# Altium schematic sheet FMs.SchDoc
size A2
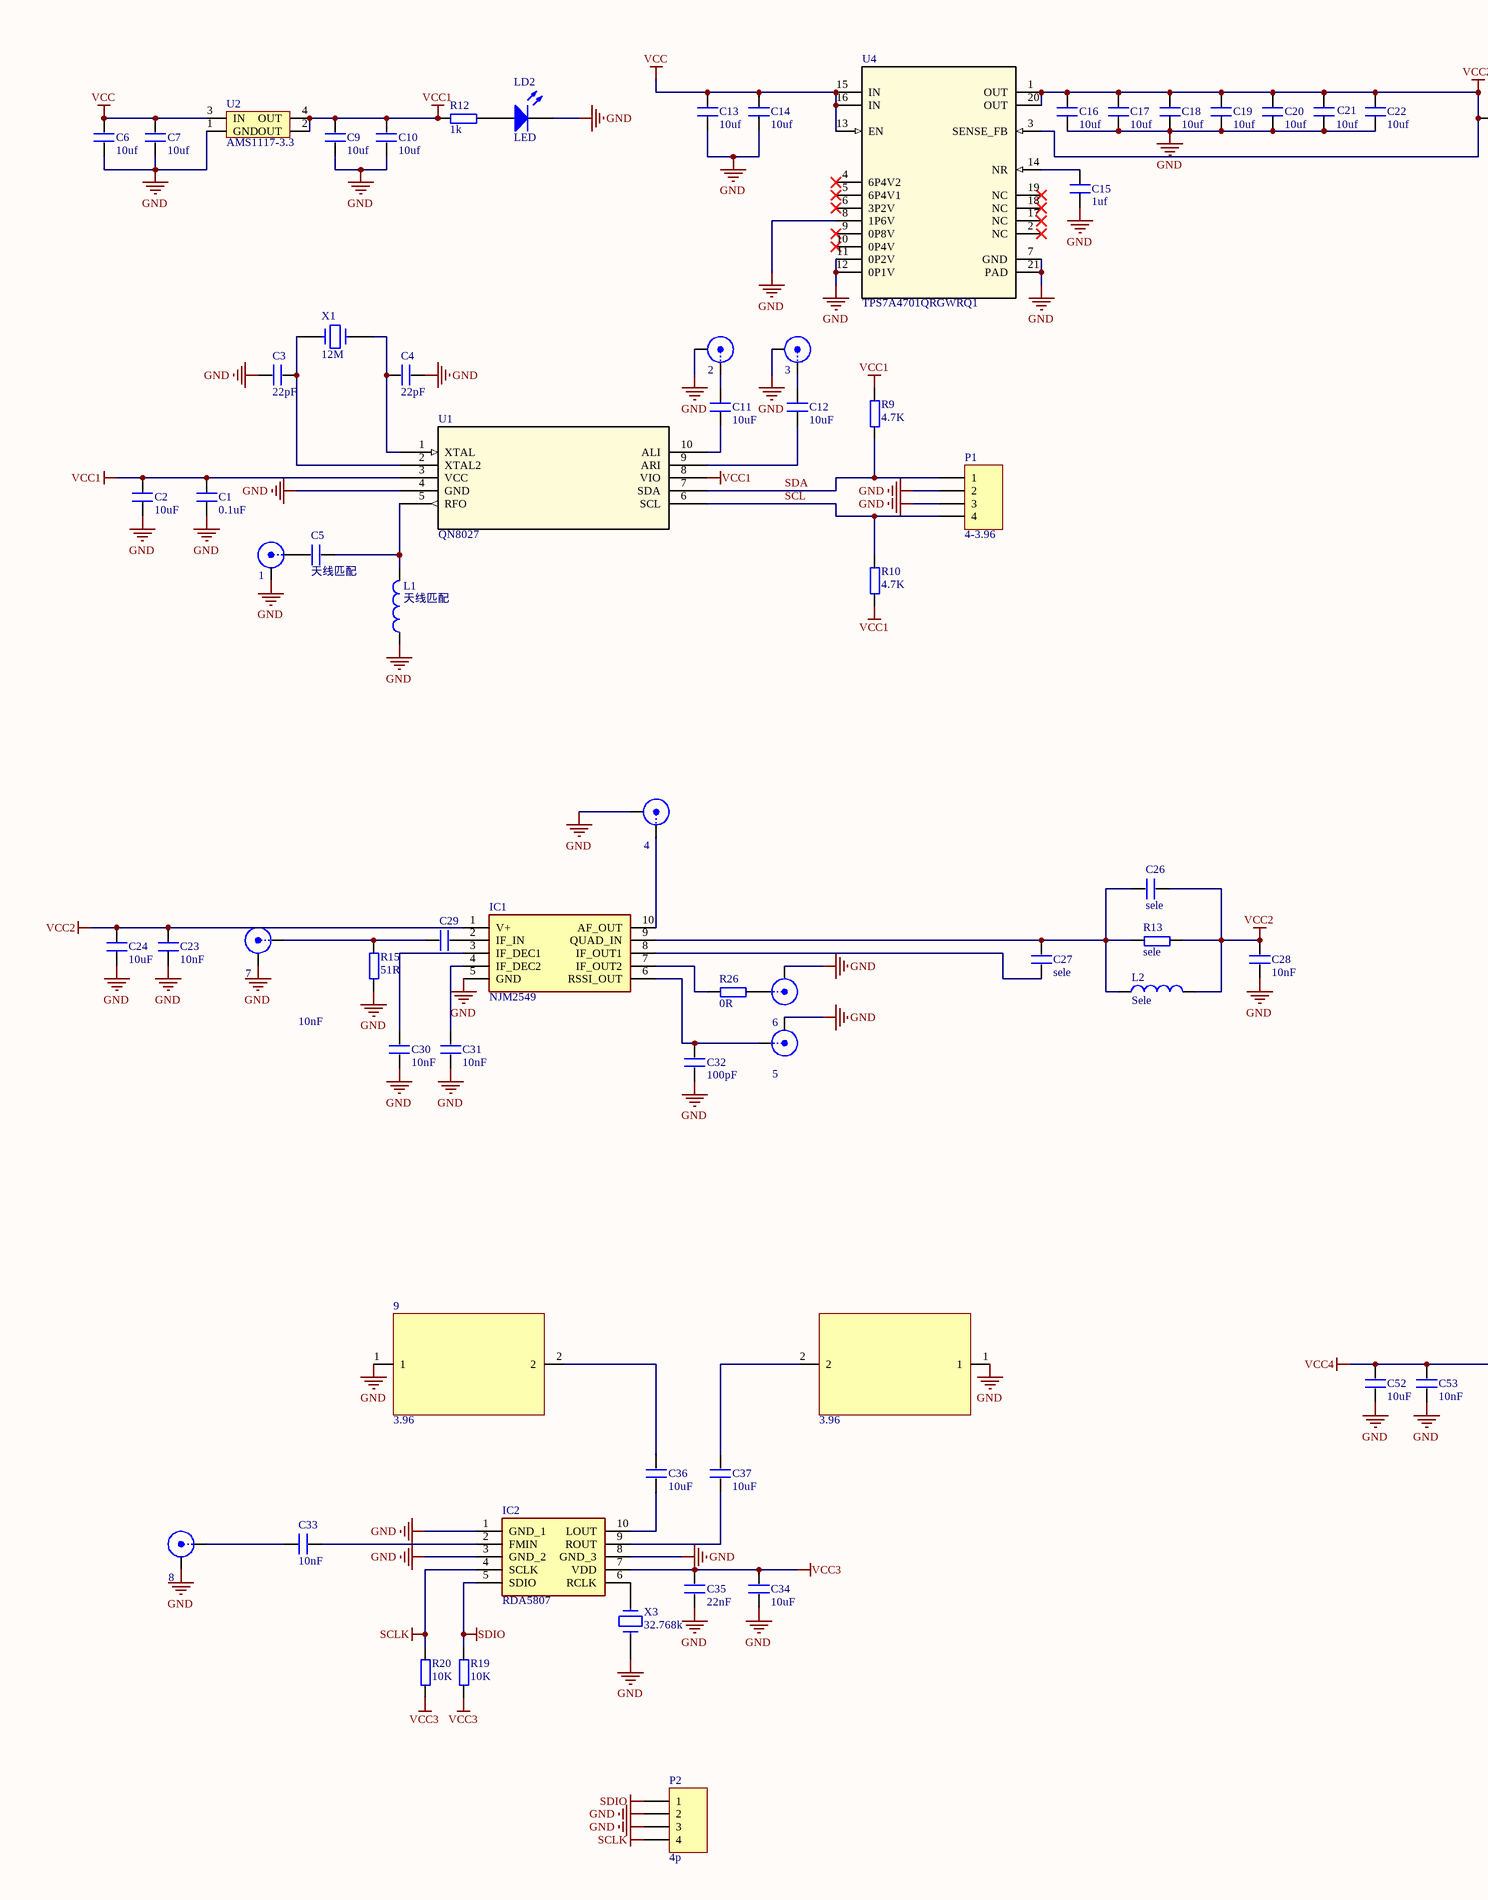
[diagram p0: FMs.SchDoc, left]
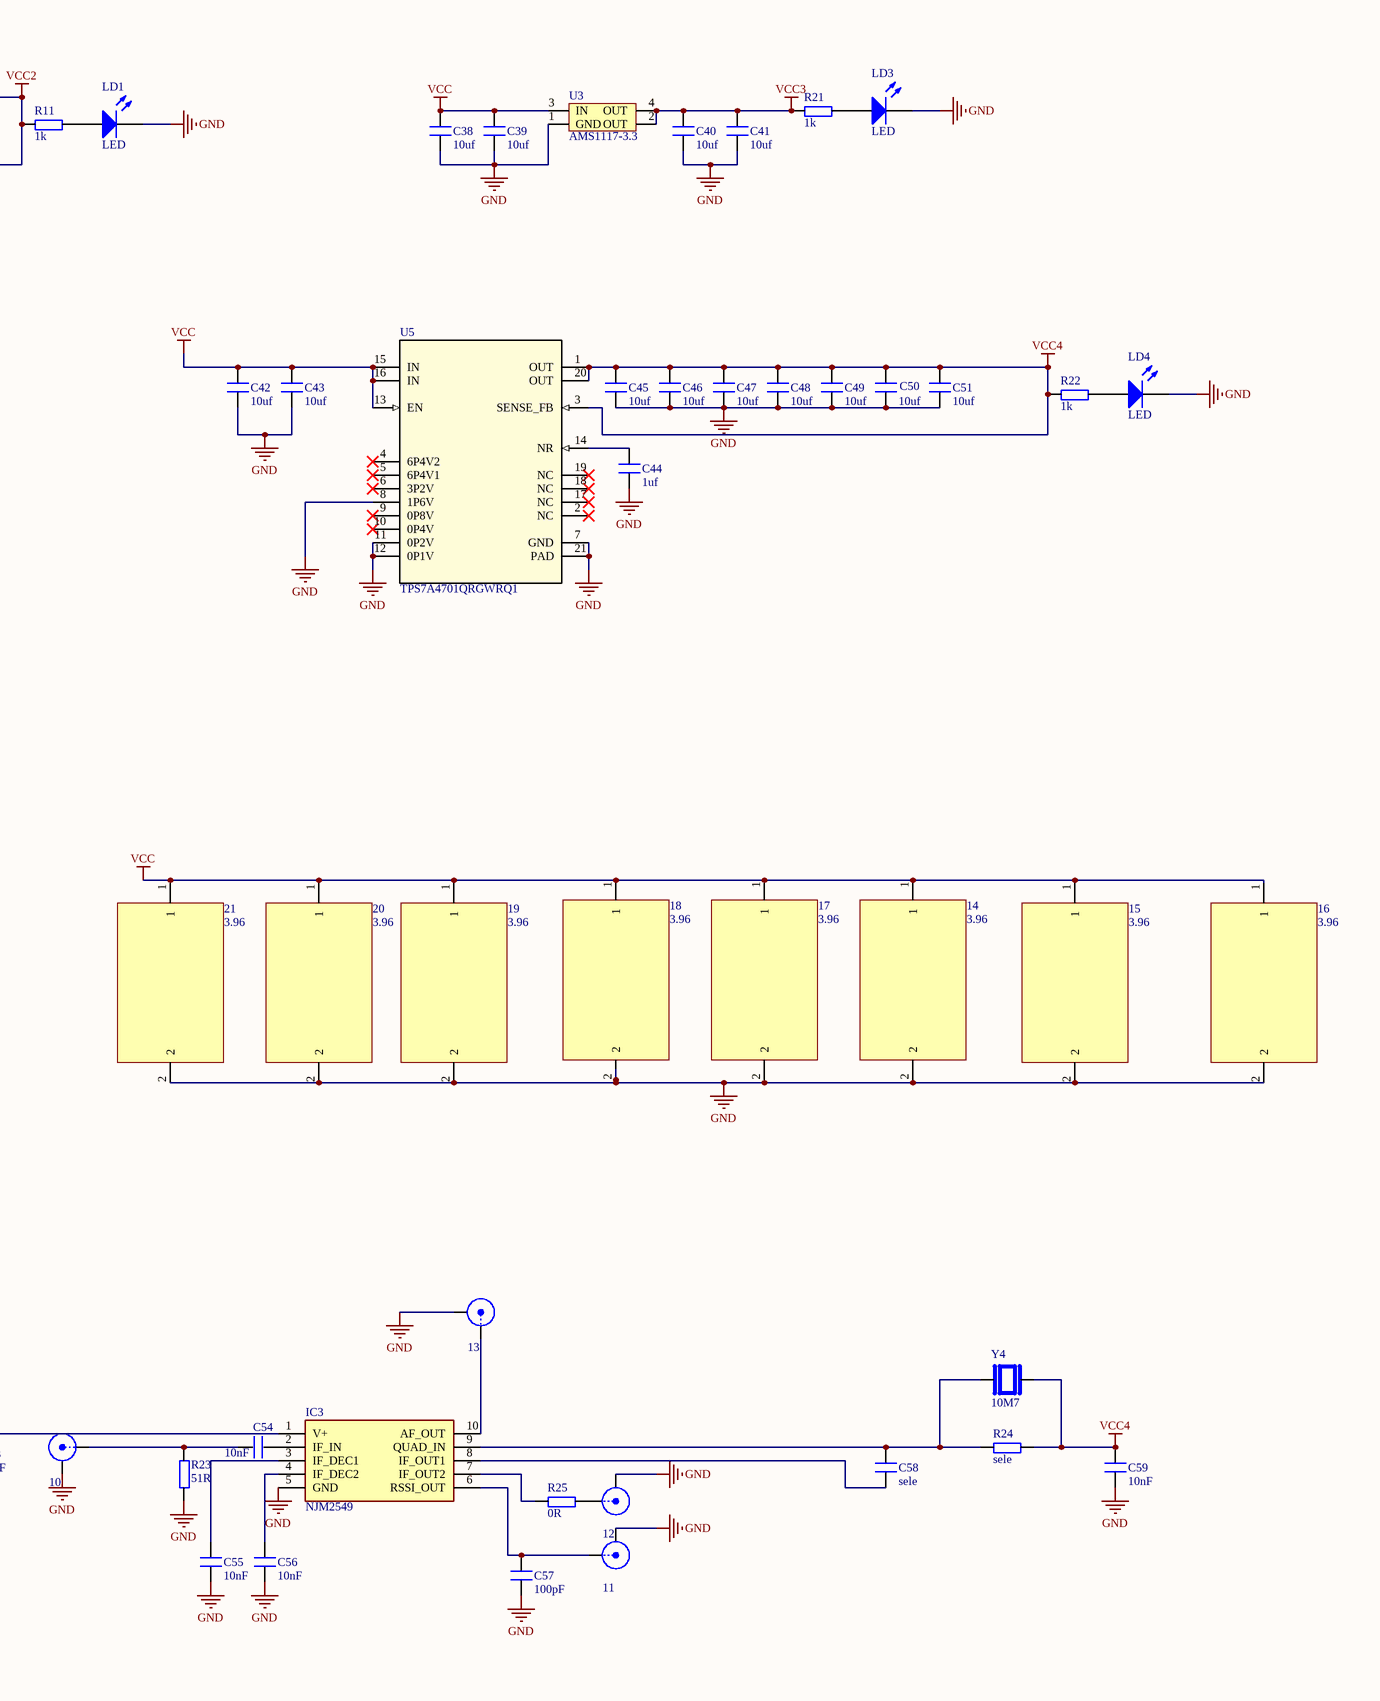
[diagram p1: FMs.SchDoc, right]

## Parts
1  SMA  [SMA]  (value not drawn)
2  SMA  [SMA]  (value not drawn)
3  SMA  [SMA]  (value not drawn)
4  SMA  [SMA]  (value not drawn)
5  SMA  [SMA]  (value not drawn)
6  SMA  [SMA]  (value not drawn)
7  SMA  [SMA]  (value not drawn)
8  SMA  [SMA]  (value not drawn)
9  3.96  [3.96]
10  SMA  [SMA]  (value not drawn)
11  SMA  [SMA]  (value not drawn)
12  SMA  [SMA]  (value not drawn)
13  SMA  [SMA]  (value not drawn)
14  3.96  [3.96]
15  3.96  [3.96]
16  3.96  [3.96]
17  3.96  [3.96]
18  3.96  [3.96]
19  3.96  [3.96]
20  3.96  [3.96]
21  3.96  [3.96]
?  3.96  [3.96]
C1  0.1uF  [0402]
C2  10uF  [0402]
C3  22pF  [0603C]
C4  22pF  [0603C]
C5  天线匹配  [0402]
C6  10uf  [0603C]
C7  10uf  [0603C]
C9  10uf  [0603C]
C10  10uf  [0603C]
C11  10uF  [0603C]
C12  10uF  [0603C]
C13  10uf  [0603C]
C14  10uf  [0603C]
C15  1uf  [0402]
C16  10uf  [0603C]
C17  10uf  [0603C]
C18  10uf  [0603C]
C19  10uf  [0603C]
C20  10uf  [0603C]
C21  10uf  [0603C]
C22  10uf  [0603C]
C23  10nF  [0603C]
C24  10uF  [0603C]
C26  sele  [0603C]
C27  sele  [0402]
C28  10nF  [0603C]
C29  10nF  [0402]
C30  10nF  [0402]
C31  10nF  [0402]
C32  100pF  [0603C]
C33  10nF  [0402]
C34  10uF  [0603C]
C35  22nF  [0603C]
C36  10uF  [0603C]
C37  10uF  [0603C]
C38  10uf  [0603C]
C39  10uf  [0603C]
C40  10uf  [0603C]
C41  10uf  [0603C]
C42  10uf  [0603C]
C43  10uf  [0603C]
C44  1uf  [0402]
C45  10uf  [0603C]
C46  10uf  [0603C]
C47  10uf  [0603C]
C48  10uf  [0603C]
C49  10uf  [0603C]
C50  10uf  [0603C]
C51  10uf  [0603C]
C52  10uF  [0603C]
C53  10nF  [0603C]
C54  10nF  [0402]
C55  10nF  [0402]
C56  10nF  [0402]
C57  100pF  [0603C]
C58  sele  [0402]
C59  10nF  [0603C]
IC1  NJM2549  [SOP50P400X100-10N]
IC2  RDA5807  [SOP50P490X110-10N]
IC3  NJM2549  [SOP50P400X100-10N]
L1  天线匹配  [0603L]
L2  Sele  [0805]
LD1  LED  [SMDLED]
LD2  LED  [SMDLED]
LD3  LED  [SMDLED]
LD4  LED  [SMDLED]
P1  4-3.96  [HDR1X4]
P2  4p  [HDR1X4]
R9  4.7K  [0603R]
R10  4.7K  [0603R]
R11  1k  [0603R]
R12  1k  [0603R]
R13  sele  [0402]
R15  51R  [0603R]
R19  10K  [0603R]
R20  10K  [0603R]
R21  1k  [0603R]
R22  1k  [0603R]
R23  51R  [0402]
R24  sele  [0402]
R25  0R  [0402]
R26  0R  [0402]
U1  QN8027  [MUB10A]
U2  AMS1117-3.3  [AMS1117]
U3  AMS1117-3.3  [AMS1117]
U4  TPS7A4701QRGWRQ1  [RGW0020A]
U5  TPS7A4701QRGWRQ1  [RGW0020A]
X1  12M  [XTAL-HCM49]
X3  32.768k  [XTAL32-2]
Y4  10M7  [XTAL_CDSCB10M7GA135-R0]

## Nets
GND: 1.2(Y) 2.2(Y) 3.2(Y) 4.2(Y) 5.2(Y) 6.2(Y) 7.2(Y) 8.2(Y) 9.1 10.2(Y) 11.2(Y) 12.2(Y) 13.2(Y) 14.2 15.2 16.2 17.2 18.2 19.2 20.2 21.2 ?.1 C1.1 C2.1 C3.2 C4.2 C6.1 C7.1 C9.1 C10.1 C13.1 C14.1 C15.1 C16.1 C17.1 C18.1 C19.1 C20.1 C21.1 C22.1 C23.1 C24.1 C28.1 C30.1 C31.2 C32.1 C34.1 C35.1 C38.1 C39.1 C40.1 C41.1 C42.1 C43.1 C44.1 C45.1 C46.1 C47.1 C48.1 C49.1 C50.1 C51.1 C52.1 C53.1 C55.1 C56.2 C57.1 C59.1 IC1.5(GND) IC2.1(GND_1) IC2.3(GND_2) IC2.8(GND_3) IC3.5(GND) L1.1 LD1.2(K) LD2.2(K) LD3.2(K) LD4.2(K) P1.2 P1.3 P2.2 P2.3 R15.1 R23.1 U1.4(GND) U2.1(GND) U3.1(GND) U4.7(GND) U4.8(1P6V) U4.11(0P2V) U4.12(0P1V) U4.21(PAD) U5.7(GND) U5.8(1P6V) U5.11(0P2V) U5.12(0P1V) U5.21(PAD) X3.1
SCLK: IC2.4(SCLK) P2.4 R20.2
SDIO: IC2.5(SDIO) P2.1 R19.2
VCC: 14.1 15.1 16.1 17.1 18.1 19.1 20.1 21.1 C6.2 C7.2 C13.2 C14.2 C38.2 C39.2 C42.2 C43.2 U2.3(IN) U3.3(IN) U4.13(EN) U4.15(IN) U4.16(IN) U5.13(EN) U5.15(IN) U5.16(IN)
VCC1: C1.2 C2.2 C9.2 C10.2 R9.2 R10.1 R12.1 U1.3(VCC) U1.8(VIO) U2.2(OUT) U2.4(OUT)
VCC2: C16.2 C17.2 C18.2 C19.2 C20.2 C21.2 C22.2 C23.2 C24.2 C26.1 C28.2 IC1.1(V+) L2.2 R11.1 R13.2 U4.1(OUT) U4.3(SENSE_FB) U4.20(OUT)
VCC3: C34.2 C35.2 C40.2 C41.2 IC2.7(VDD) R19.1 R20.1 R21.1 U3.2(OUT) U3.4(OUT)
VCC4: C45.2 C46.2 C47.2 C48.2 C49.2 C50.2 C51.2 C52.2 C53.2 C59.2 IC3.1(V+) R22.1 R24.2 U5.1(OUT) U5.3(SENSE_FB) U5.20(OUT) Y4.2
SCL: P1.4 R10.2 U1.6(SCL)
SDA: P1.1 R9.1 U1.7(SDA)
Net1_1: 1.1(X) C5.1
Net2_1: 2.1(X) C11.2
Net3_1: 3.1(X) C12.2
Net4_1: 4.1(X) IC1.10(AF_OUT)
Net5_1: 5.1(X) C32.2 IC1.6(RSSI_OUT)
Net6_1: 6.1(X) R26.2
Net7_1: 7.1(X) C29.1 R15.2
Net8_1: 8.1(X) C33.1
Net9_2: 9.2 C36.2
Net10_1: 10.1(X) C54.1 R23.2
Net11_1: 11.1(X) C57.2 IC3.6(RSSI_OUT)
Net12_1: 12.1(X) R25.2
Net13_1: 13.1(X) IC3.10(AF_OUT)
Net?_2: ?.2 C37.2
NetC3_1: C3.1 U1.2(XTAL2) X1.1
NetC4_1: C4.1 U1.1(XTAL) X1.2
NetC5_2: C5.2 L1.2 U1.5(RFO)
NetC11_1: C11.1 U1.10(ALI)
NetC12_1: C12.1 U1.9(ARI)
NetC15_2: C15.2 U4.14(NR)
NetC26_2: C26.2 C27.2 IC1.9(QUAD_IN) L2.1 R13.1
NetC27_1: C27.1 IC1.8(IF_OUT1)
NetC29_2: C29.2 IC1.2(IF_IN)
NetC30_2: C30.2 IC1.3(IF_DEC1)
NetC31_1: C31.1 IC1.4(IF_DEC2)
NetC33_2: C33.2 IC2.2(FMIN)
NetC36_1: C36.1 IC2.10(LOUT)
NetC37_1: C37.1 IC2.9(ROUT)
NetC44_2: C44.2 U5.14(NR)
NetC54_2: C54.2 IC3.2(IF_IN)
NetC55_2: C55.2 IC3.3(IF_DEC1)
NetC56_1: C56.1 IC3.4(IF_DEC2)
NetC58_1: C58.1 IC3.8(IF_OUT1)
NetC58_2: C58.2 IC3.9(QUAD_IN) R24.1 Y4.1
NetIC1_7: IC1.7(IF_OUT2) R26.1
NetIC2_6: IC2.6(RCLK) X3.2
NetIC3_7: IC3.7(IF_OUT2) R25.1
NetLD1_1: LD1.1(A) R11.2
NetLD2_1: LD2.1(A) R12.2
NetLD3_1: LD3.1(A) R21.2
NetLD4_1: LD4.1(A) R22.2

Not connected (* = marked no-connect by the designer): U4 2(NC)* 4(6P4V2)* 5(6P4V1)* 6(3P2V)* 9(0P8V)* 10(0P4V)* 17(NC)* 18(NC)* 19(NC)*; U5 2(NC)* 4(6P4V2)* 5(6P4V1)* 6(3P2V)* 9(0P8V)* 10(0P4V)* 17(NC)* 18(NC)* 19(NC)*

## Library data of the parts
1-8 10-13 = SMA: SMA Connector
C1-C7 C9-C24 C26-C59 = C: Capacitor
IC1 IC3 = NJM2549: Integrated Circuit; Manufacturer_Name: New Japan Radio; Datasheet Link: https://www.njr.com/semicon/PDF/NJM2549_E.pdf; Height: 1mm; Manufacturer_Part_Number: NJM2549
IC2 = RDA5807: Integrated Circuit; Manufacturer_Name: RDA Microelectronics; Datasheet Link: http://cxem.net/tuner/files/tuner84_RDA5807M_datasheet_v1.pdf; Height: 1.1mm; Manufacturer_Part_Number: RDA5807
L1 L2 = Inductor: Value: 100uH; Published: 8-Jun-2000; Revision: July-2002: Re-released for DXP Platform.; Publisher: Altium Limited
LD1-LD4 = LED: Typical RED, GREEN, YELLOW, AMBER GaAs LED; Published: 8-Jun-2000; LatestRevisionDate: 17-Jul-2002; LatestRevisionNote: Re-released for DXP Platform.; PackageDocument: Feb-2002; PackageReference: 3.2X1.6X1.1; Publisher: Altium Limited
P1 P2 = Header 4: Header, 4-Pin; LatestRevisionDate: 17-Jul-2002; LatestRevisionNote: Re-released for DXP Platform.; Publisher: Altium Limited
R9-R13 R15 R19-R26 = Resistor
U1 = QN8027: FM发射; Manufacturer_Part_Number: LM5020MM-2/NOPB; Vendor: Texas Instruments; Built_By: EMA_UL_Team; Copyright: Copyright (C) 2018 Accelerated Designs. All rights reserved; RefDes: RefDes; Type: DEV; Value: Value
U2 U3 = AMS1117
U4 U5 = TPS7A4701QRGWRQ1: No Description Available; Manufacturer: Texas Instruments; PartNumber: TPS7A4701QRGWRQ1; RefDes: RefDes; Type: DEV; Value: Value; Copyright: Copyright (C) 2018 Accelerated Designs. All rights reserved
X1 X3 = XTAL: Crystal
Y4 = CDSCB10M7GA135-R0: Signal Conditioning; MF: Murata; Package: None; Value: *; MP: CDSCB10M7GA135-R0; Availability: Unavailable; Price: None